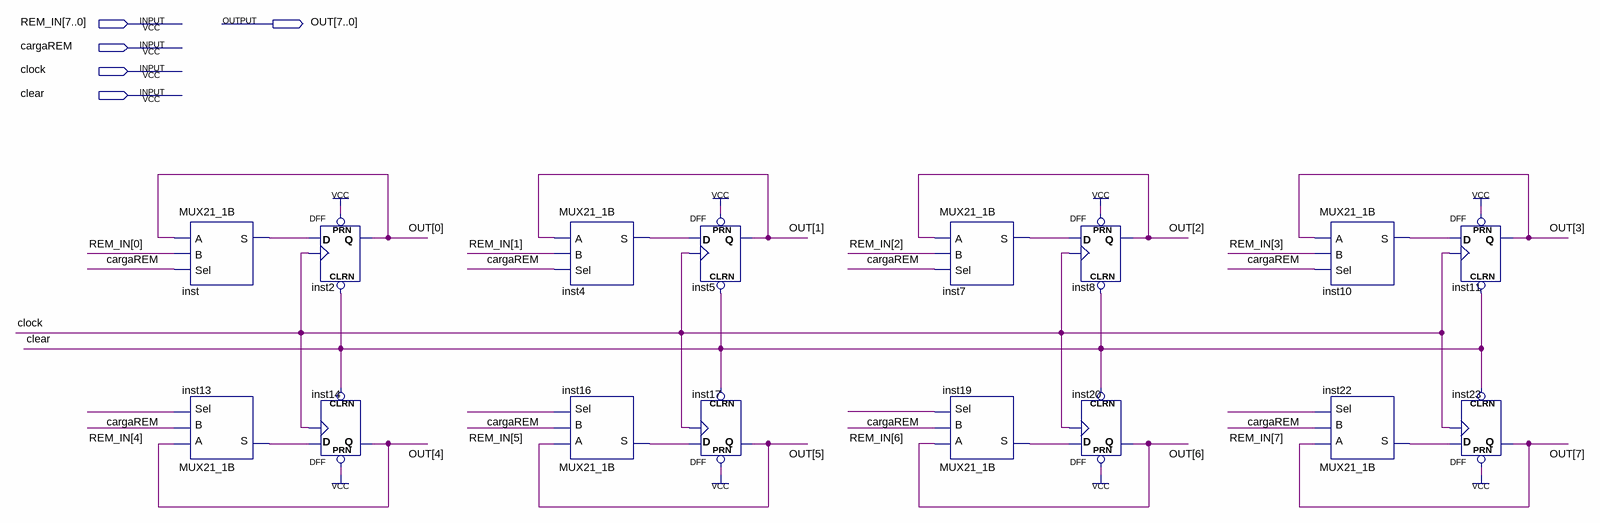
[diagram p0: schematic sheet]
// Quartus schematic REM.bdf as structural Verilog: 16 symbols, 5 pins
module REM (
  input  [7:0] REM_IN,
  input  cargaREM,
  input  clock,
  input  clear,
  output [7:0] OUT
);

  wire inst4_s, inst7_s, inst10_s, inst13_s, inst16_s, inst19_s, inst22_s, inst_s;

  MUX21_1B inst (.A(OUT[0]), .B(REM_IN[0]), .Sel(cargaREM), .S(inst_s));
  MUX21_1B inst13 (.A(OUT[4]), .B(REM_IN[4]), .Sel(cargaREM), .S(inst13_s));
  DFF inst2 (.CLRN(clear), .CLK(clock), .D(inst_s), .PRN(1'b1), .Q(OUT[0]));
  DFF inst14 (.CLRN(clear), .CLK(clock), .D(inst13_s), .PRN(1'b1), .Q(OUT[4]));
  MUX21_1B inst4 (.A(OUT[1]), .B(REM_IN[1]), .Sel(cargaREM), .S(inst4_s));
  MUX21_1B inst16 (.A(OUT[5]), .B(REM_IN[5]), .Sel(cargaREM), .S(inst16_s));
  DFF inst5 (.CLRN(clear), .CLK(clock), .D(inst4_s), .PRN(1'b1), .Q(OUT[1]));
  DFF inst17 (.CLRN(clear), .CLK(clock), .D(inst16_s), .PRN(1'b1), .Q(OUT[5]));
  MUX21_1B inst7 (.A(OUT[2]), .B(REM_IN[2]), .Sel(cargaREM), .S(inst7_s));
  MUX21_1B inst19 (.A(OUT[6]), .B(REM_IN[6]), .Sel(cargaREM), .S(inst19_s));
  DFF inst8 (.CLRN(clear), .CLK(clock), .D(inst7_s), .PRN(1'b1), .Q(OUT[2]));
  DFF inst20 (.CLRN(clear), .CLK(clock), .D(inst19_s), .PRN(1'b1), .Q(OUT[6]));
  MUX21_1B inst10 (.A(OUT[3]), .B(REM_IN[3]), .Sel(cargaREM), .S(inst10_s));
  MUX21_1B inst22 (.A(OUT[7]), .B(REM_IN[7]), .Sel(cargaREM), .S(inst22_s));
  DFF inst11 (.CLRN(clear), .CLK(clock), .D(inst10_s), .PRN(1'b1), .Q(OUT[3]));
  DFF inst23 (.CLRN(clear), .CLK(clock), .D(inst22_s), .PRN(1'b1), .Q(OUT[7]));
endmodule
